# EasyEDA schematic SCH_fall_detection_2025-05-21.json
TITLE: Sheet_1; REV: 1.0; Date: 2024-12-04; Sheet: 1/1; Drawn By: rakib_57; Company: Your Company
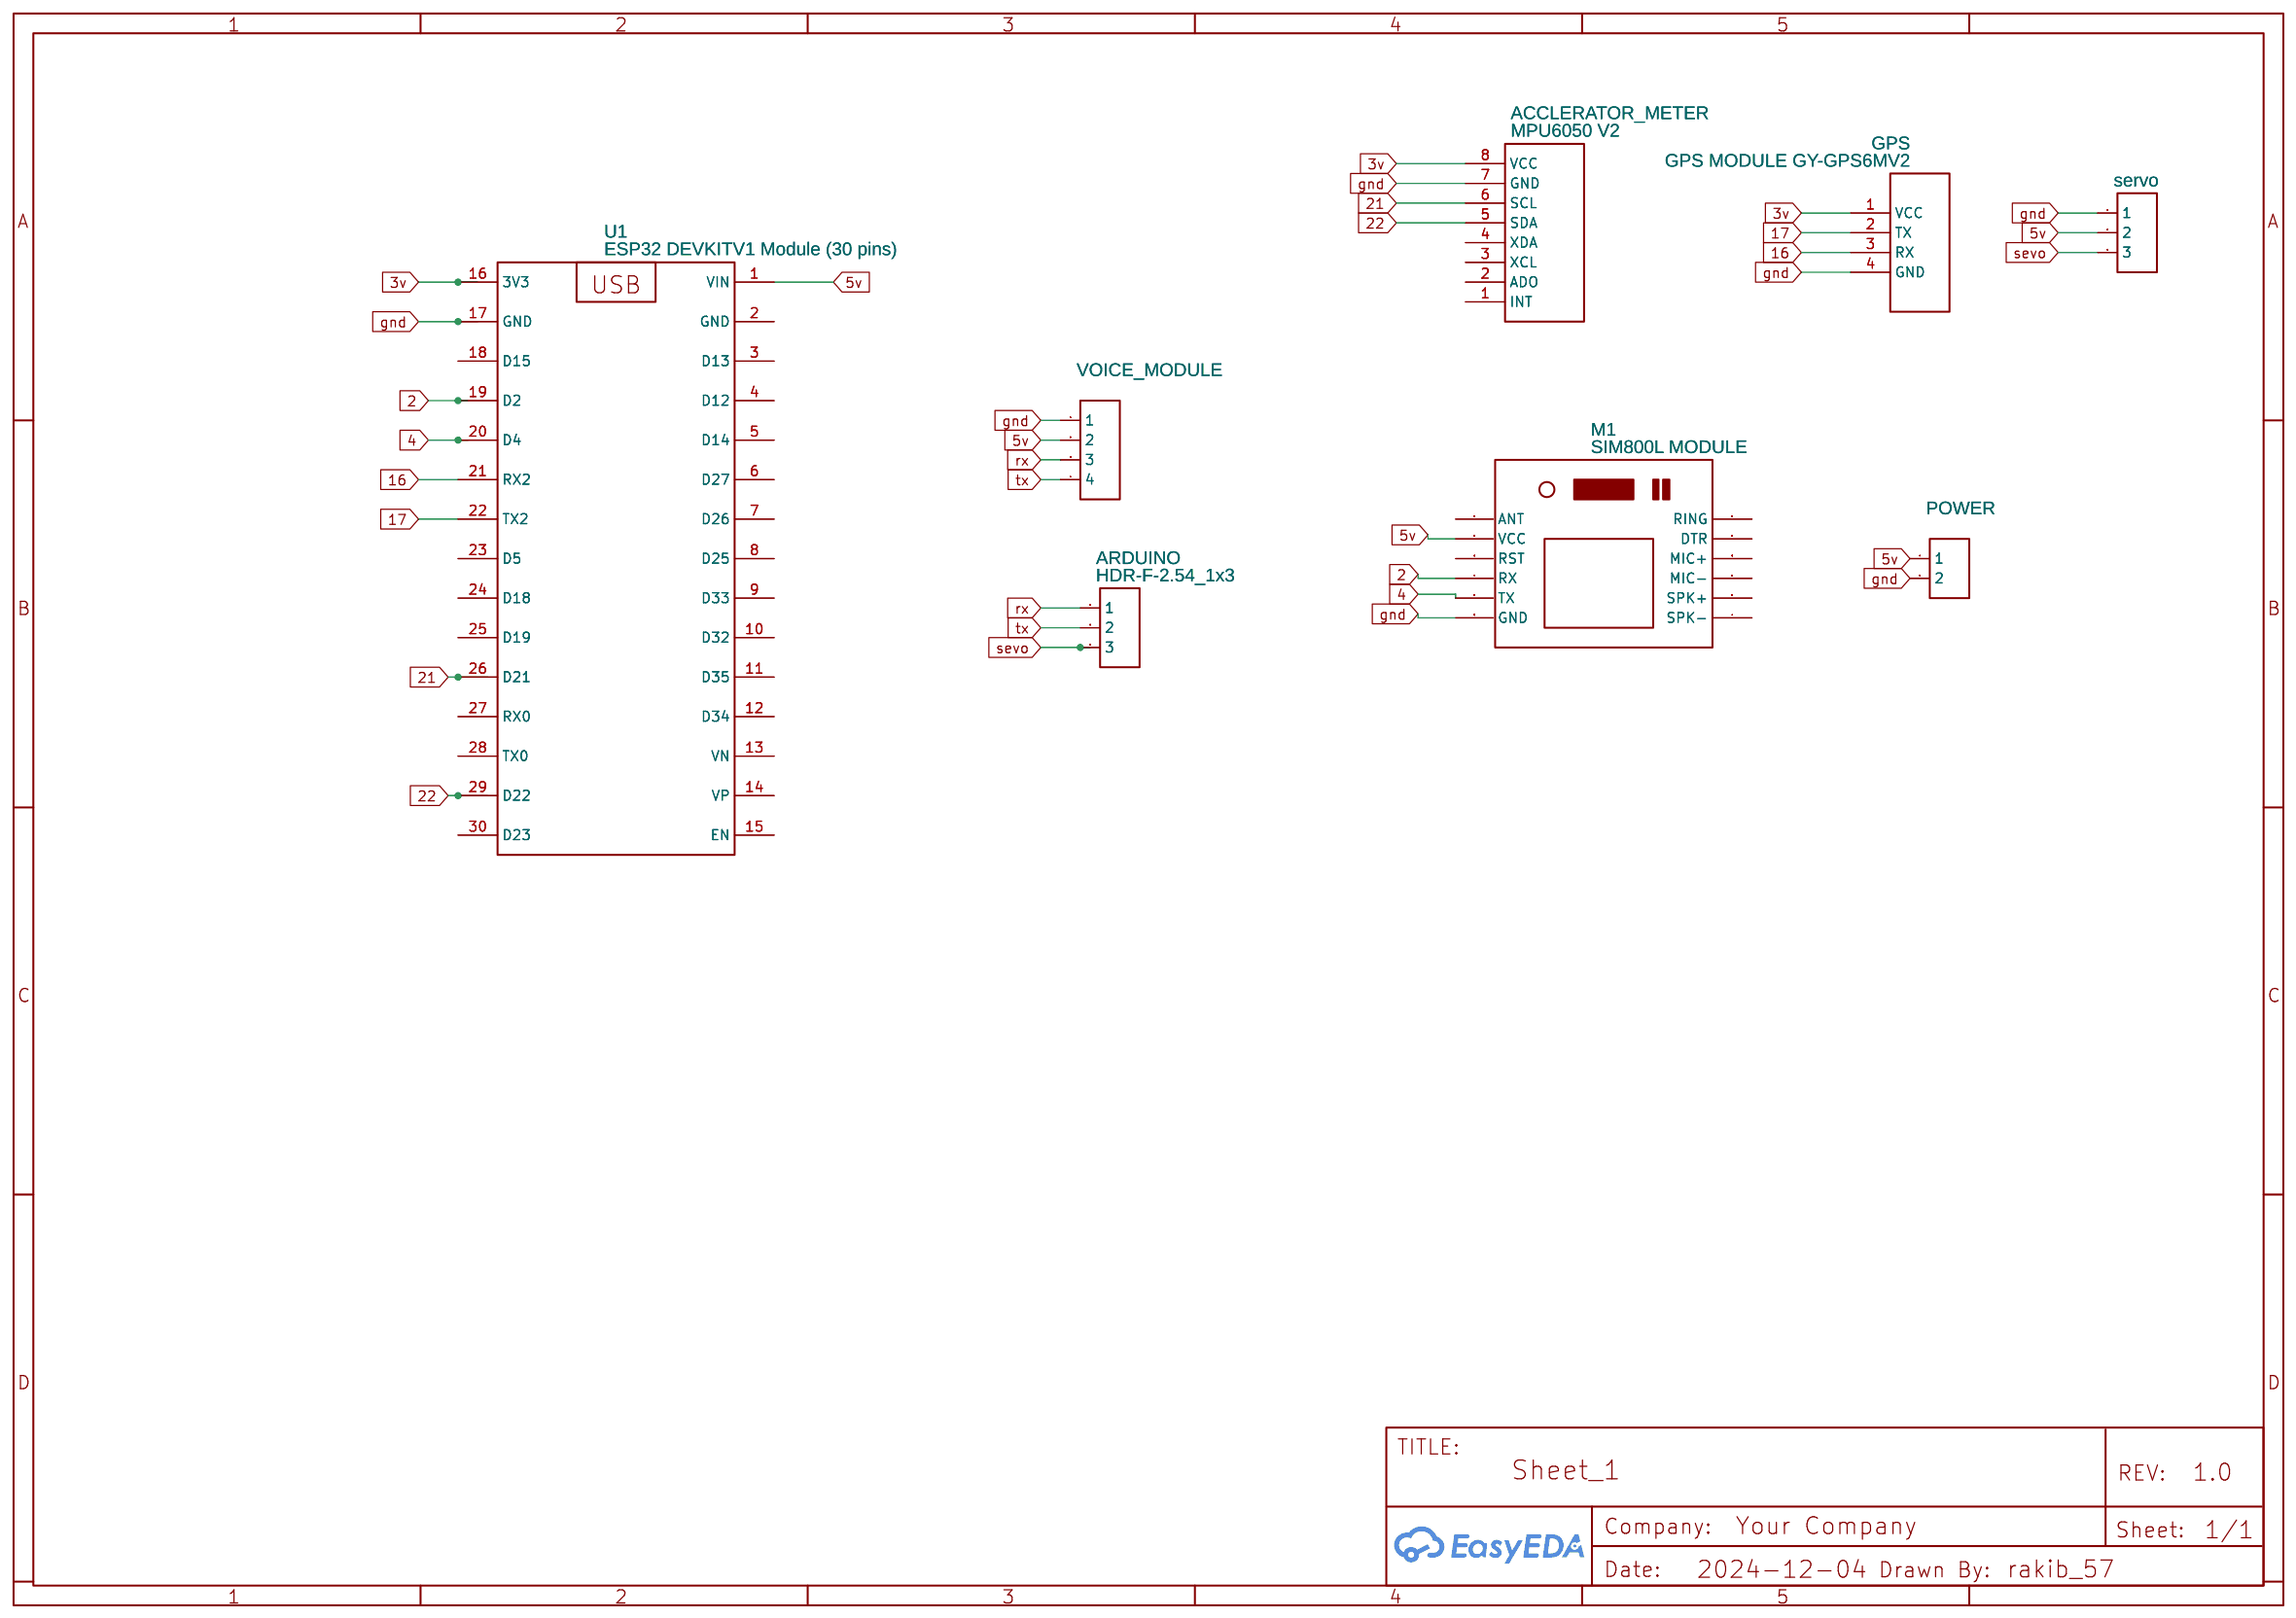
[diagram p0: schematic sheet]

## Parts
ACCLERATOR_METER  MPU6050 V2  [MPU6050 V2]
ARDUINO  HDR-F-2.54_1x3  [HDR-F-2.54_1X3]
GPS  GPS MODULE GY-GPS6MV2  [GPS MODULE GY-GPS6MV2]
M1  SIM800L MODULE  [SIM800L]
POWER  HDR-F-2.54_1x2  [HDR-F-2.54_1X2]
SERVO  servo  [HDR-F-2.54_1X3]
U1  ESP32 DEVKITV1 Module (30 pins)  [ESP32 DEVKITV1 MODULE (30 PINS)]
VOICE_MODULE  HDR-F-2.54_1x4  [HDR-F-2.54_1X4]

## Library data of the parts
ACCLERATOR_METER = MPU6050 V2: Contributor: Marc-andré Morneau
ARDUINO SERVO = HDR-F-2.54_1x3: Supplier Part: C146690; Supplier: LCSC; Contributor: LCEDA_Lib
GPS = GPS MODULE GY-GPS6MV2: Contributor: hashnol
M1 = SIM800L MODULE COPY: Contributor: twins4tech
POWER = HDR-F-2.54_1x2: Supplier Part: C49661; Supplier: LCSC; Contributor: LCEDA_Lib
U1 = ESP32 DEVKITV1 Module (30 pins): Contributor: Diego_AC
VOICE_MODULE = HDR-F-2.54_1x4: Supplier Part: C225501; Supplier: LCSC; Contributor: LCEDA_Lib

## Nets
3v: ACCLERATOR_METER.8(VCC) GPS.1(VCC) U1.16(3V3)
5v: M1.2(VCC) POWER.1 SERVO.2 U1.1(VIN) VOICE_MODULE.2
gnd: ACCLERATOR_METER.7(GND) GPS.4(GND) M1.6(GND) POWER.2 SERVO.1 U1.17(GND) VOICE_MODULE.1
2: M1.4(RX) U1.19(D2)
4: M1.5(TX) U1.20(D4)
16: GPS.3(RX) U1.21(RX2)
17: GPS.2(TX) U1.22(TX2)
21: ACCLERATOR_METER.6(SCL) U1.26(D21)
22: ACCLERATOR_METER.5(SDA) U1.29(D22)
rx: ARDUINO.1 VOICE_MODULE.3
sevo: ARDUINO.3 SERVO.3
tx: ARDUINO.2 VOICE_MODULE.4

Not connected (* = marked no-connect by the designer): ACCLERATOR_METER 1(INT) 2(ADO) 3(XCL) 4(XDA); M1 1(ANT) 3(RST) 7(SPK-) 8(SPK+) 9(MIC-) 10(MIC+) 11(DTR) 12(RING); U1 2(GND) 3(D13) 4(D12) 5(D14) 6(D27) 7(D26) 8(D25) 9(D33) 10(D32) 11(D35) 12(D34) 13(VN) 14(VP) 15(EN) 18(D15) 23(D5) 24(D18) 25(D19) 27(RX0) 28(TX0) 30(D23)
